# EAGLE schematic es_shield (EAGLE 9.6.2)
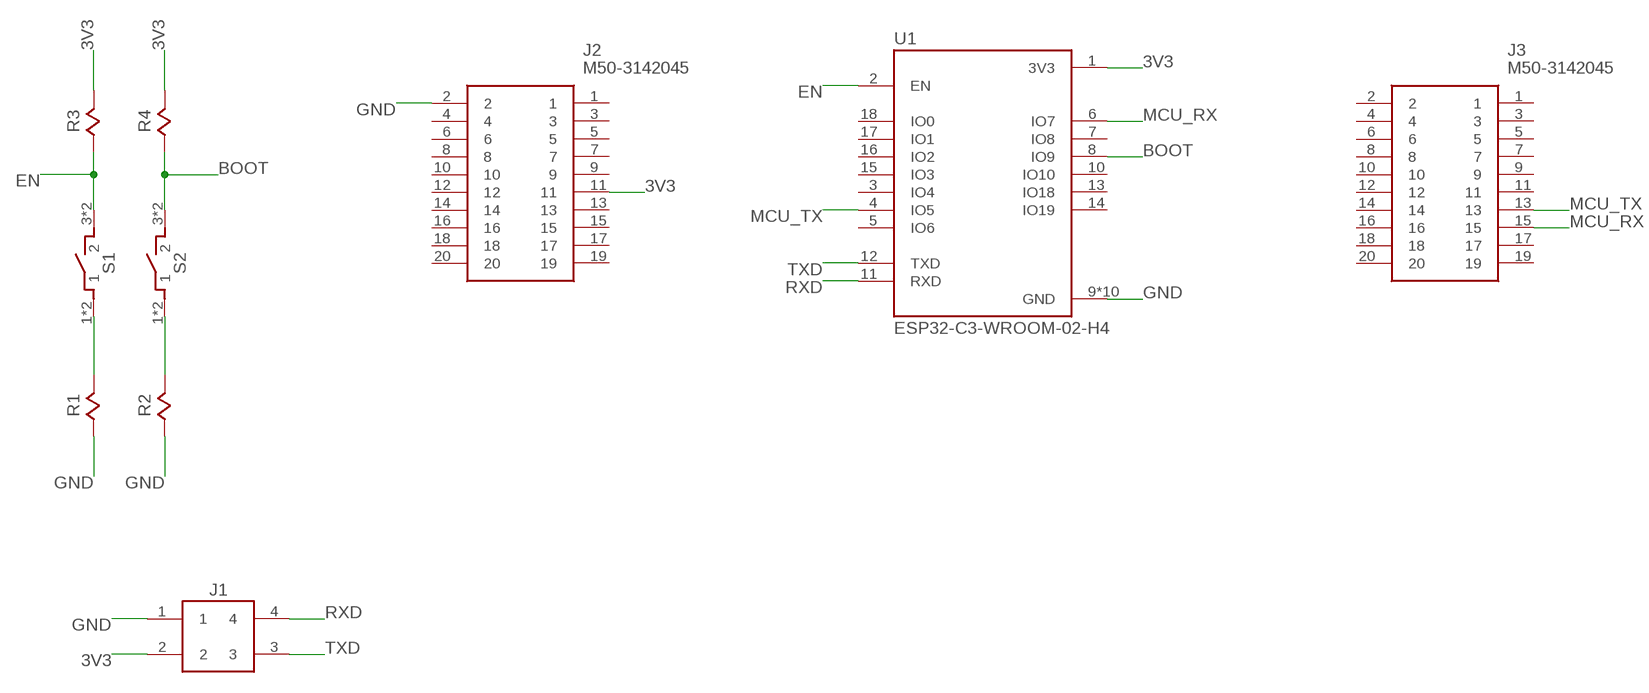
[diagram p0: schematic, sheet 1]

## Parts
J1  MALE_HEADER_4X1  [4X1_HEADER]
J2  M50-3142045  [M503142045]
J3  M50-3142045  [M503142045]
R1  RESISTOR  [0805]
R2  RESISTOR  [0805]
R3  RESISTOR  [0805]
R4  RESISTOR  [0805]
S1  TACTILE-SWITCH  [TACTILE-SWITCH]
S2  TACTILE-SWITCH  [TACTILE-SWITCH]
U1  ESP32-C3-WROOM-02-H4  [MODULE_ESP32-C3-WROOM-02-H4]

## Nets
3V3: J1.2 J2.11 R3.2 R4.2 U1.1(3V3)
BOOT: R4.1 S2.3 S2.4 U1.8(IO9)
EN: R3.1 S1.3 S1.4 U1.2(EN)
GND: J1.1 J2.2 R1.1 R2.1 U1.9(GND) U1.19(GND) U1.20(GND) U1.21(GND) U1.22(GND) U1.23(GND) U1.24(GND) U1.25(GND) U1.26(GND) U1.27(GND)
MCU_RX: J3.15 U1.6(IO7)
MCU_TX: J3.13 U1.4(IO5)
N$3: R1.2 S1.1 S1.2
N$4: R2.2 S2.1 S2.2
RXD: J1.4 U1.11(RXD)
TXD: J1.3 U1.12(TXD)
Unconnected: J2.1 J2.3 J2.4 J2.5 J2.6 J2.7 J2.8 J2.9 J2.10 J2.12 J2.13 J2.14 J2.15 J2.16 J2.17 J2.18 J2.19 J2.20 J3.1 J3.2 J3.3 J3.4 J3.5 J3.6 J3.7 J3.8 J3.9 J3.10 J3.11 J3.12 J3.14 J3.16 J3.17 J3.18 J3.19 J3.20 U1.3(IO4) U1.5(IO6) U1.7(IO8) U1.10(IO10) U1.13(IO18) U1.14(IO19) U1.15(IO3) U1.16(IO2) U1.17(IO1) U1.18(IO0)

## Library data of the parts
J1 = esp32_shield:MALE_HEADER_4X1
J2 J3 = esp32_shield:M50-3142045: Headers & Wire Housings 20 WAY SIL VERT SMT SKT Source: Datasheet <https://componentsearchengine.com/Datasheets/1/M50-3142045.pdf>; DESCRIPTION: Headers & Wire Housings 20 WAY SIL VERT SMT SKT; HEIGHT: 3.6mm; MANUFACTURER_NAME: Harwin; MANUFACTURER_PART_NUMBER: M50-3142045; MOUSER_PART_NUMBER: 855-M50-3142045; MOUSER_PRICE-STOCK: https://www.mouser.co.uk/ProductDetail/Harwin/M50-3142045/?qs=%252BdQmOuGyFcFpETieNSWjAg%3D%3D
R1-R4 = esp32_shield:RESISTOR
S1 S2 = esp32_shield:TACTILE-SWITCH: 612-TL3365AF180QG
U1 = esp32_shield:ESP32-C3-WROOM-02-H4: WiFi Modules (802.11) (Engineering Samples) SMD module, ESP32-C3, 4MB SPI flash, PCB antenna, -40 C +105 C; MANUFACTURER: Espressif; MAXIMUM_PACKAGE_HEIGHT: 3.35 mm; PARTREV: V1.0; STANDARD: Manufacturer Recommendations